# Altium schematic sheet Control_tensiones.SchDoc
size A3
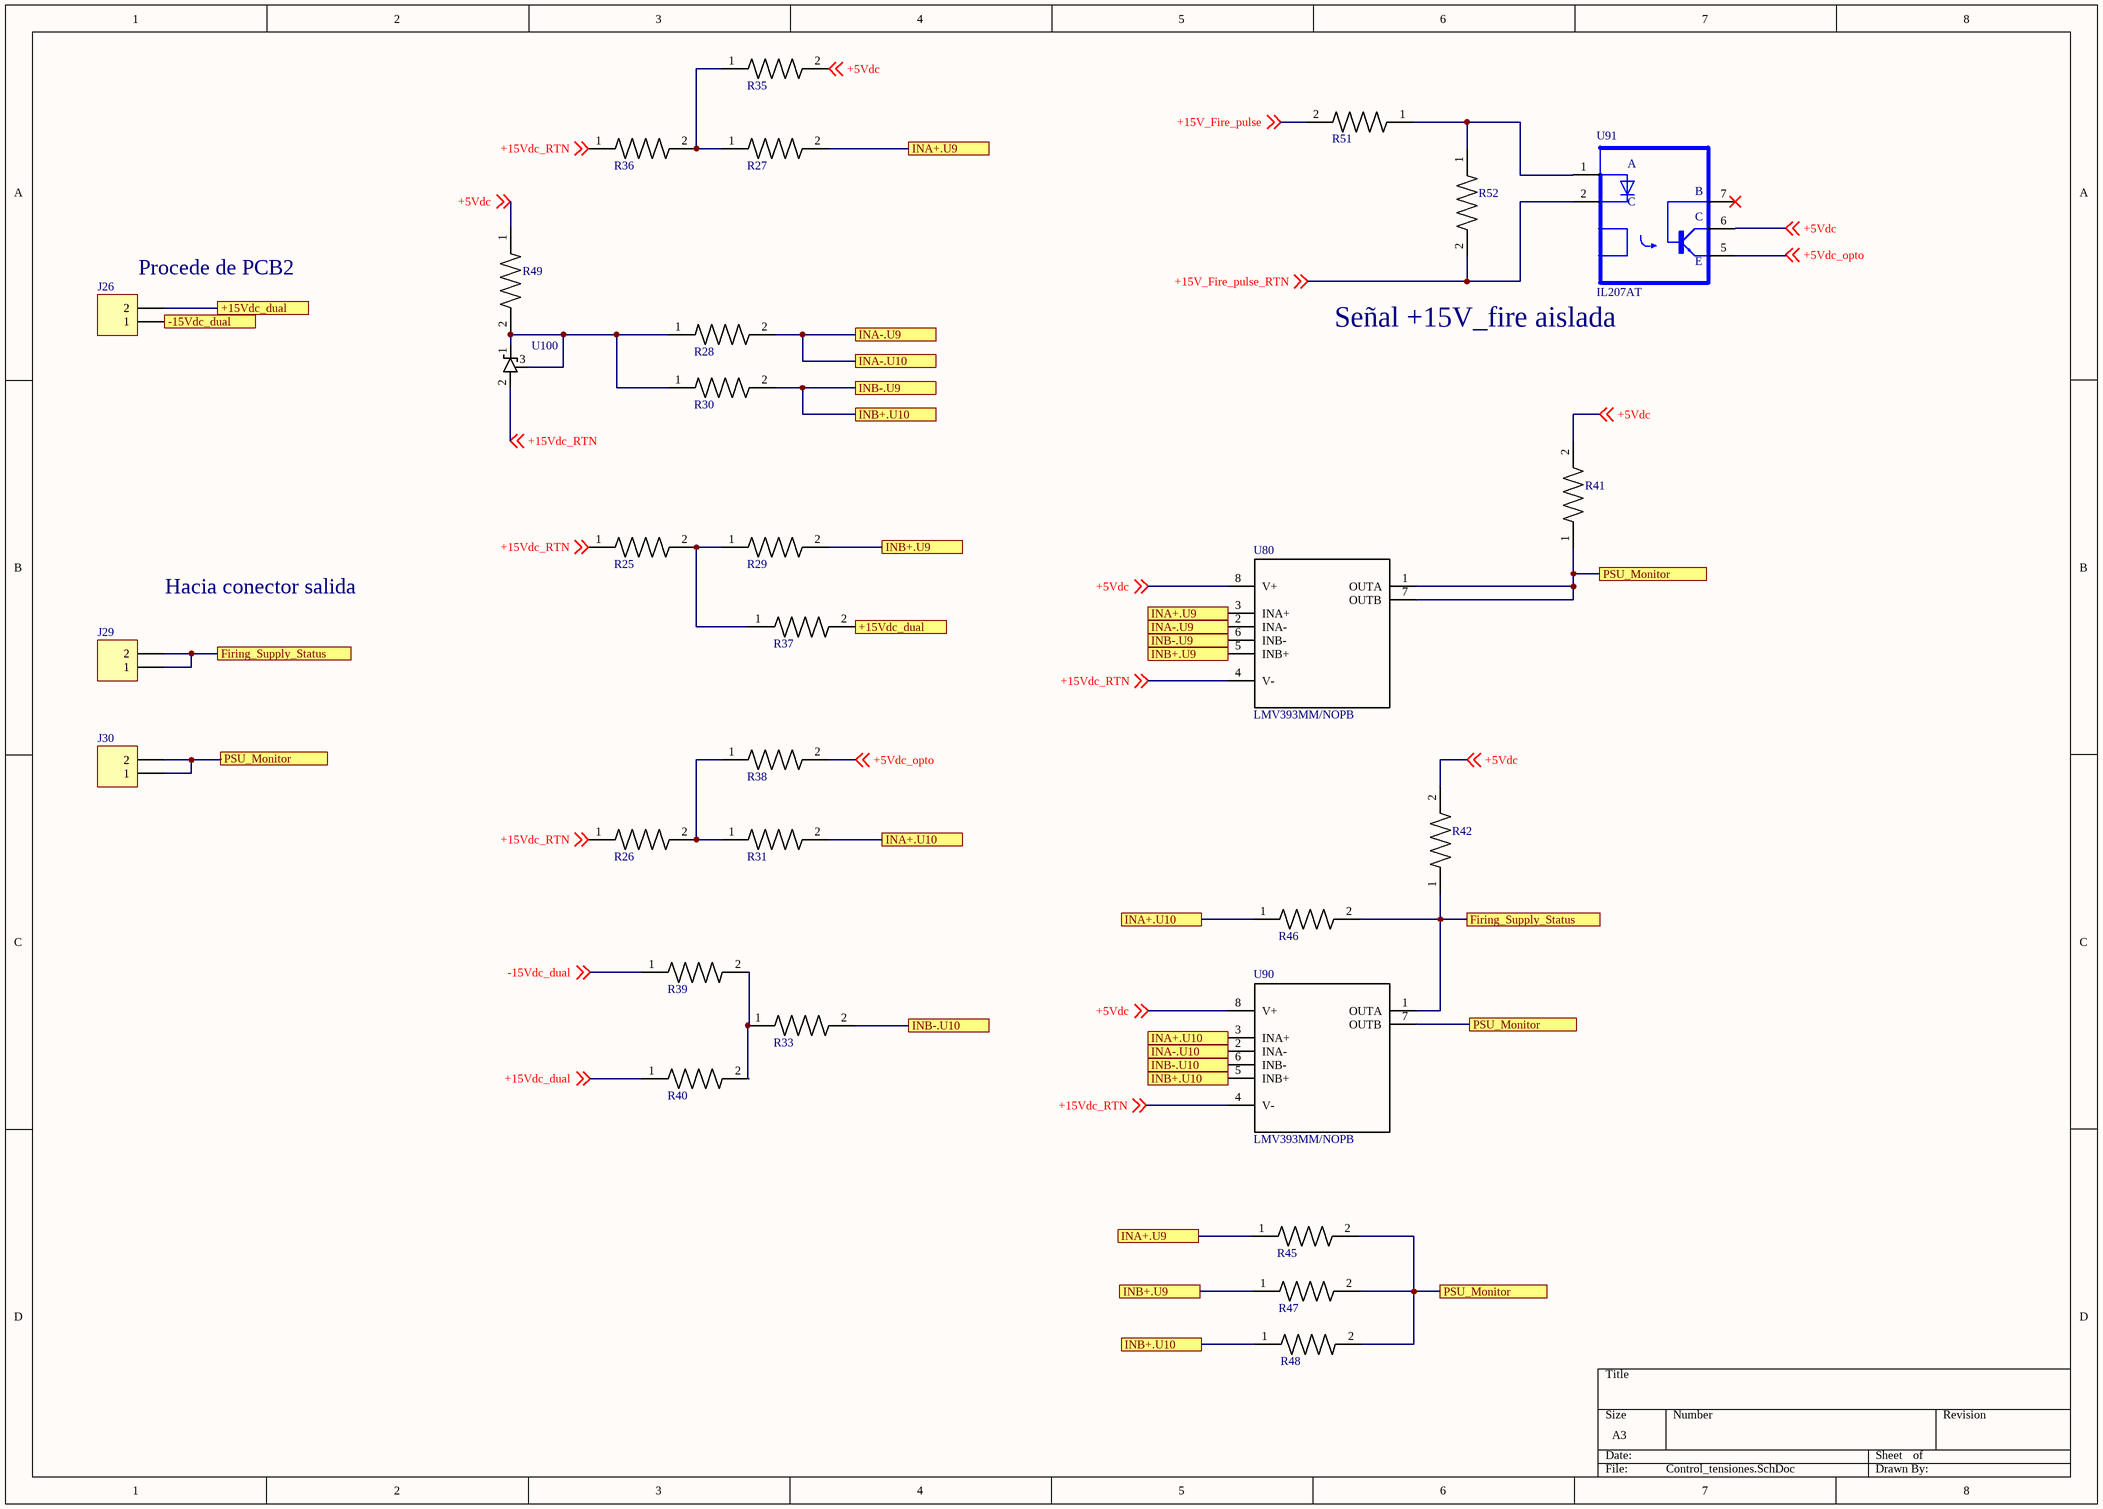
[diagram p0: Control_tensiones.SchDoc]

## Parts
J26  Header 2  [HDR1X2]  (value not drawn)
J29  Header 2  [HDR1X2]  (value not drawn)
J30  Header 2  [HDR1X2]  (value not drawn)
R25  MCT06030C2261FP500  [VISHAY RESISTOR 0603]  (value not drawn)
R26  MCT06030C2261FP500  [VISHAY RESISTOR 0603]  (value not drawn)
R27  MCT06030C4751FP500  [VISHAY RESISTOR 0603]  (value not drawn)
R28  MCT06030C4751FP500  [VISHAY RESISTOR 0603]  (value not drawn)
R29  MCT06030C4751FP500  [VISHAY RESISTOR 0603]  (value not drawn)
R30  MCT06030C4751FP500  [VISHAY RESISTOR 0603]  (value not drawn)
R31  MCT06030C4751FP500  [VISHAY RESISTOR 0603]  (value not drawn)
R33  MCT06030C4751FP500  [VISHAY RESISTOR 0603]  (value not drawn)
R35  MCT06030C8251FP500  [VISHAY RESISTOR 0603]  (value not drawn)
R36  MCT06030E1002BP500  [VISHAY RESISTOR 0603]  (value not drawn)
R37  MCT06030E1002BP500  [VISHAY RESISTOR 0603]  (value not drawn)
R38  MCT06030C8251FP500  [VISHAY RESISTOR 0603]  (value not drawn)
R39  MCT06030E1002BP500  [VISHAY RESISTOR 0603]  (value not drawn)
R40  MCT06030E1002BP500  [VISHAY RESISTOR 0603]  (value not drawn)
R41  MCT06030E1002BP500  [VISHAY RESISTOR 0603]  (value not drawn)
R42  MCT06030E1002BP500  [VISHAY RESISTOR 0603]  (value not drawn)
R45  MCT06030C2213FP500  [VISHAY RESISTOR 0603]  (value not drawn)
R46  MCT06030C2213FP500  [VISHAY RESISTOR 0603]  (value not drawn)
R47  MCT06030C2213FP500  [VISHAY RESISTOR 0603]  (value not drawn)
R48  MCT06030C2213FP500  [VISHAY RESISTOR 0603]  (value not drawn)
R49  MCT06030C1001FP500  [VISHAY RESISTOR 0603]  (value not drawn)
R51  CR1206-FX-3921ELF  [Vishay Resistor 1206]  (value not drawn)
R52  CR1206-FX-2211ELF  [Vishay Resistor 1206]  (value not drawn)
U80  LMV393MM/NOPB  [VSSOP-8]
U90  LMV393MM/NOPB  [VSSOP-8]
U91  IL207AT  [IL207AT]
U100  LM431BIM3/NOPB  [LM431BIM3/NOPB]  (value not drawn)

## Ports
+15Vdc_dual, -15Vdc_dual, Firing_Supply_Status, INA+.U9, INA+.U10, INA-.U9, INA-.U10, INB+.U9, INB+.U10, INB-.U9, INB-.U10, PSU_Monitor

## Nets
+5Vdc: R35.2 R41.2 R42.2 R49.1 U80.8(V+) U90.8(V+) U91.6(C) ; off-sheet +5Vdc
+5Vdc_opto: R38.2 U91.5(E) ; off-sheet +5Vdc_opto
+15V_Fire_pulse: R51.2 ; off-sheet +15V_Fire_pulse
+15V_Fire_pulse_RTN: R52.2 U91.2(K) ; off-sheet +15V_Fire_pulse_RTN
+15Vdc_dual: J26.2 R37.2 ; port +15Vdc_dual
+15Vdc_dual: R40.1 ; off-sheet +15Vdc_dual  [a separate net that carries the same name]
+15Vdc_RTN: R25.1 R26.1 R36.1 U80.4(V-) U90.4(V-) U100.2 ; off-sheet +15Vdc_RTN
-15Vdc_dual: J26.1 ; port -15Vdc_dual
-15Vdc_dual: R39.1 ; off-sheet -15Vdc_dual  [a separate net that carries the same name]
Firing_Supply_Status: J29.1 J29.2 R42.1 R46.2 U90.1(OUTA) ; port Firing_Supply_Status
INA+.U9: R27.2 R45.1 U80.3(INA+) ; port INA+.U9
INA+.U10: R31.2 R46.1 U90.3(INA+) ; port INA+.U10
INA-.U10: R28.2 U80.2(INA-) U90.2(INA-) ; port INA-.U9, port INA-.U10
INB+.U9: R29.2 R47.1 U80.5(INB+) ; port INB+.U9
INB+.U10: R30.2 R48.1 U80.6(INB-) U90.5(INB+) ; port INB-.U9, port INB+.U10
INB-.U10: R33.2 U90.6(INB-) ; port INB-.U10
PSU_Monitor: J30.1 J30.2 R41.1 R45.2 R47.2 R48.2 U80.1(OUTA) U80.7(OUTB) U90.7(OUTB) ; port PSU_Monitor
NetR25_2: R25.2 R29.1 R37.1
NetR26_2: R26.2 R31.1 R38.1
NetR27_1: R27.1 R35.1 R36.2
NetR28_1: R28.1 R30.1 R49.2 U100.1 U100.3
NetR33_1: R33.1 R39.2 R40.2
NetR51_1: R51.1 R52.1 U91.1(A)

Not connected (* = marked no-connect by the designer): U91 7(B)*

## Notes on the sheet
- (near J26) Procede de PCB2
- Señal +15V_fire aislada
- Hacia conector salida

## Library data of the parts
J26 J29 J30 = Header 2: Header, 2-Pin; LatestRevisionDate: 17-Jul-2002; LatestRevisionNote: Re-released for DXP Platform.; Publisher: Altium Limited
R25 R26 = Vishay: SMD .1W 2.26Kohms 1% 0603 50ppm; ComponentLink1Description: MCT06030C2261FP500; ComponentLink1URL: https://www.mouser.es/ProductDetail/Vishay-Beyschlag/MCT06030C2261FP500?qs=%2Fha2pyFadughkIXC22QiYpvHZcDRlhgpmBDp13US%252BZ0hODV2hOC%2FTUaEC1yDML2l
R27-R31 R33 = Vishay: SMD .1W 4.75Kohm 1% 0603; ComponentLink1Description: MCT06030C4751FP500; ComponentLink1URL: https://www.mouser.es/ProductDetail/Vishay-Beyschlag/MCT06030C4751FP500?qs=%2Fha2pyFadughkIXC22QiYi0CgI7B%2FEwZF1Ozbr1oOh0X%252BJ1hWtmp5jEjAUZkpAxV
R35 R38 = Vishay: 8.25K; ComponentLink1Description: MCT06030C8251FP500; ComponentLink1URL: https://www.mouser.es/ProductDetail/Vishay-Beyschlag/MCT06030C8251FP500?qs=sGAEpiMZZMukHu%252BjC5l7YZ4AW6xLIgwogvAy%252BPWxcIo%3D
R36 R37 R39-R42 = Vishay: 10K; ComponentLink1Description: MCT06030E1002BP500; ComponentLink1URL: https://www.mouser.es/ProductDetail/Vishay-Beyschlag/MCT06030E1002BP500?qs=%2Fha2pyFadughkIXC22QiYn1joc4AhucvlApKkzkxat0vQHQ4MiMQdVZR1CdxMQHv
R45-R48 = Vishay: 221K; ComponentLink1Description: MCT06030C2213FP500; ComponentLink1URL: https://www.mouser.es/ProductDetail/Vishay-Beyschlag/MCT06030C2213FP500?qs=%2Fha2pyFadughkIXC22QiYqLjBpdqF1aqE52QKndS2LMwEPewZL3fBw%3D%3D
R49 = Vishay: 1K; ComponentLink1Description: MCT06030C1001FP500; ComponentLink1URL: https://www.mouser.es/ProductDetail/Vishay-Beyschlag/MCT06030C1001FP500?qs=%2Fha2pyFadughkIXC22QiYtrFzwOcctIEKEUg7pOtZAzbqCmtrkpt9w%3D%3D
R51 = Vishay: SMD 3.92K 1%; ComponentLink1Description: CR1206-FX-3921ELF; ComponentLink1URL: https://www.mouser.es/ProductDetail/Bourns/CR1206-FX-3921ELF?qs=raSpJxvwqHE9GBxJCDuxsA%3D%3D
R52 = Vishay: SMD 2.21K 1%; ComponentLink1Description: CR1206-FX-2211ELF; ComponentLink1URL: https://www.mouser.es/ProductDetail/Bourns/CR1206-FX-2211ELF?qs=%2Fha2pyFaduj9c30axezgKfVr70F7xSB9ko%2Fa2tHaHRQ2Kj0njWzInQ%3D%3D
U80 U90 = LMV393MM/NOPB: Low Volt Dual Comp; ComponentLink1Description: Datasheets; ComponentLink1URL: https://www.ti.com/lit/ds/symlink/lmv393-n.pdf; ComponentLink2Description: LMV393MM/NOPB; ComponentLink2URL: https://www.mouser.es/ProductDetail/Texas-Instruments/LMV393MM-NOPB?qs=sGAEpiMZZMuayl%2FEk2kXcbEcxwmoPguckCV8aQGpZH0=
U91 = IL207AT: Optoacopladores para salidas de transistores Phototransistor Out Single CTR; ComponentLink1Description: IL207AT; ComponentLink1URL: https://www.mouser.es/ProductDetail/Vishay-Semiconductors/IL207AT?qs=llh2rRbZq4tx89Mr596kGw==&vip=1&gclid=Cj0KCQjw6uT4BRD5ARIsADwJQ1-1DfbQcymhOgpkcRTr_MH4AofkADIKJJHZSotrTBYXAbAfQbOPfvcaAg7REALw_wcB
U100 = LM431BIM3/NOPB: Referencias de voltaje ADJ PREC ZENER SHUNT REG; ComponentLink1Description: Datasheets; ComponentLink1URL: http://www.ti.com/lit/ds/symlink/lm431.pdf; ComponentLink2Description: LM431BIM3/NOPB; ComponentLink2URL: https://www.mouser.es/ProductDetail/Texas-Instruments/LM431BIM3-NOPB?qs=sGAEpiMZZMuBck1X%252B7j9fFxOFMTVQaIHvc6TlFQ3VqM%3D